# Altium schematic sheet LEDs.SchDoc
size A
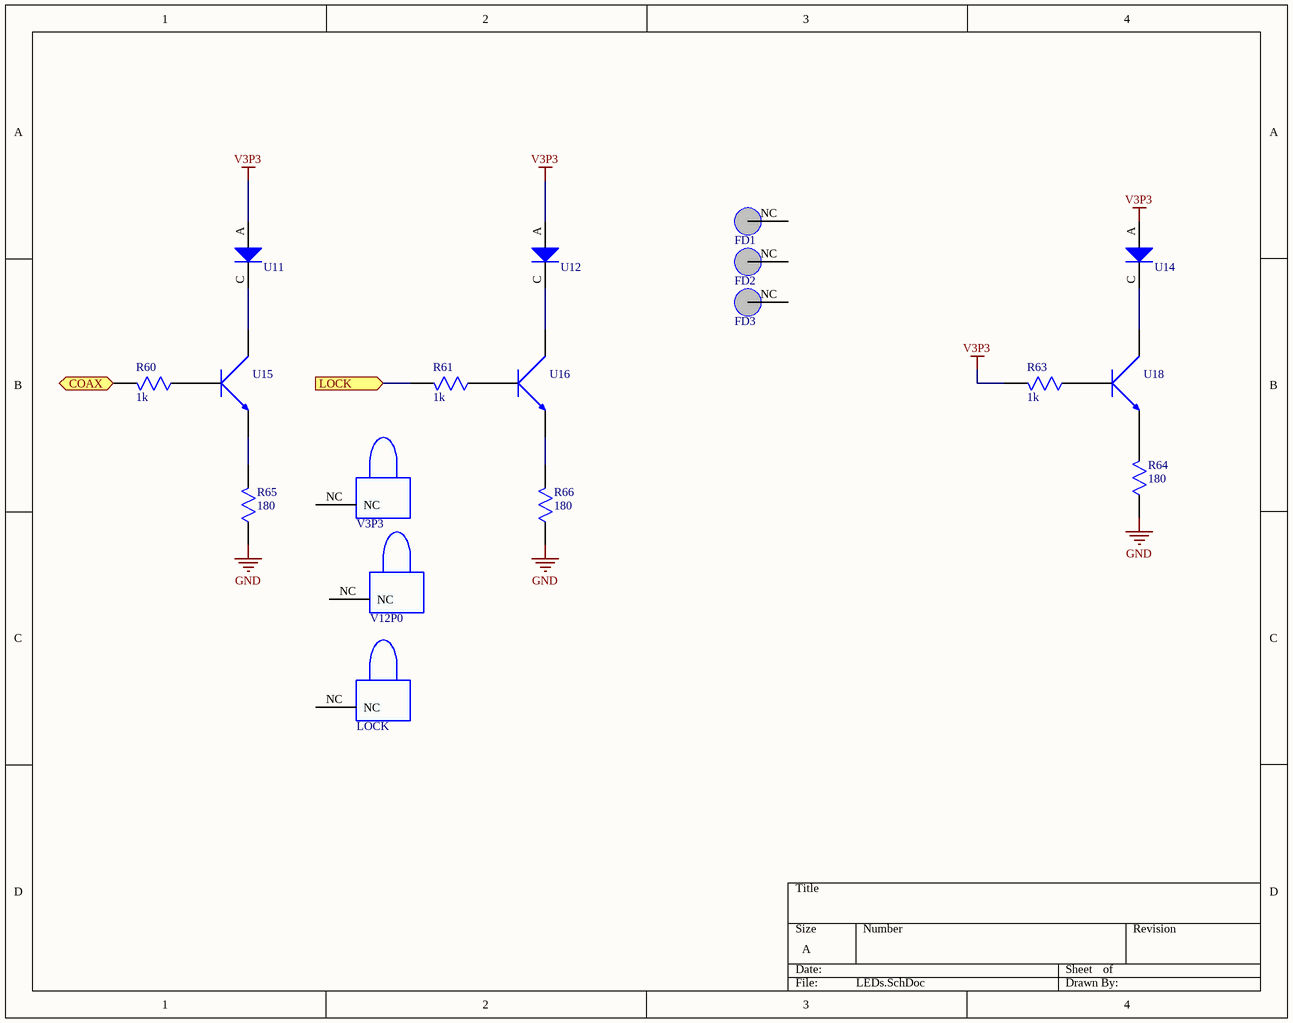
[diagram p0: LEDs.SchDoc]

## Parts
FD1  Fiducial Mark  [Fiducial Round]  (value not drawn)
FD2  Fiducial Mark  [Fiducial Round]  (value not drawn)
FD3  Fiducial Mark  [Fiducial Round]  (value not drawn)
LOCK  Light Pipe  [Light Pipe]  (value not drawn)
R60  value 1k  [SMD Resistor 0603]  (hidden comment: Resistor)
R61  value 1k  [SMD Resistor 0603]  (hidden comment: Resistor)
R63  value 1k  [SMD Resistor 0603]  (hidden comment: Resistor)
R64  value 180  [SMD Resistor 0603]  (hidden comment: Resistor)
R65  value 180  [SMD Resistor 0603]  (hidden comment: Resistor)
R66  value 180  [SMD Resistor 0603]  (hidden comment: Resistor)
U11  LED  [LED_0603]  (value not drawn)
U12  LED  [LED_0603]  (value not drawn)
U14  LED  [LED_0603]  (value not drawn)
U15  transistor NPN  [SOT23127P600-8N]  (value not drawn)
U16  transistor NPN  [SOT23127P600-8N]  (value not drawn)
U18  transistor NPN  [SOT23127P600-8N]  (value not drawn)
V3P3  Light Pipe  [Light Pipe]  (value not drawn)
V12P0  Light Pipe  [Light Pipe]  (value not drawn)

## Ports
COAX (in), LOCK (in)

## Nets
GND: R64.0 R65.0 R66.0
V3P3: R63.1 U11.A U12.A U14.A
COAX: R60.1 ; port COAX
LOCK: R61.1 ; port LOCK
NetR60_0: R60.0 U15.B
NetR61_0: R61.0 U16.B
NetR63_0: R63.0 U18.B
NetR64_1: R64.1 U18.E
NetR65_1: R65.1 U15.E
NetR66_1: R66.1 U16.E
NetU11_C: U11.C U15.C
NetU12_C: U12.C U16.C
NetU14_C: U14.C U18.C

Not connected (* = marked no-connect by the designer): FD1 NC; FD2 NC; FD3 NC; LOCK NC; V3P3 NC; V12P0 NC